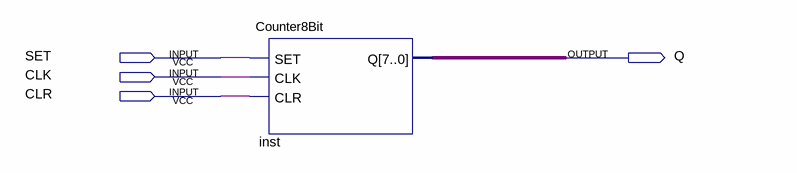
[diagram p0: schematic sheet]
// Quartus schematic Counter8Bit.bdf as structural Verilog: 1 symbols, 4 pins
module Counter8Bit (
  input  SET,
  input  CLK,
  input  CLR,
  output Q
);

  wire [7:0] inst_q;

  Counter8Bit inst (.SET(SET), .CLK(CLK), .CLR(CLR), .Q(inst_q));
endmodule
